# Altium schematic sheet PowCarbinBoard_Sensor.SchDoc
size A3
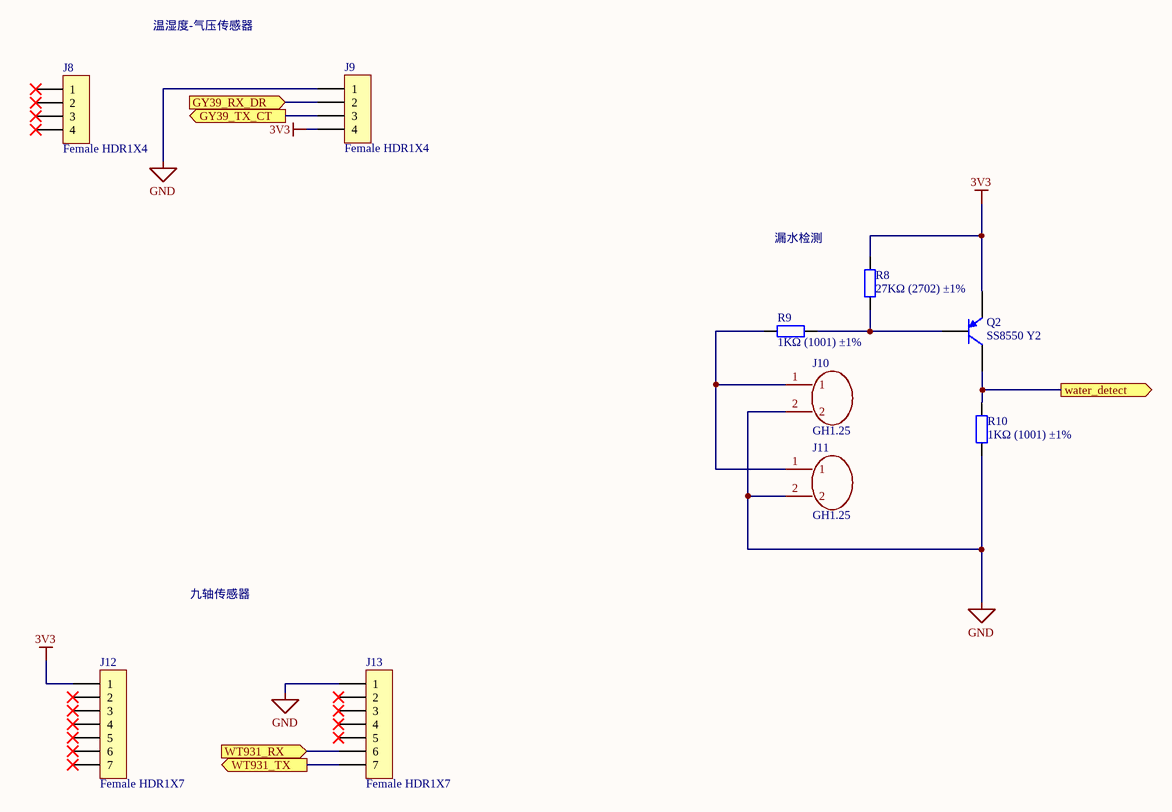
[diagram p0: PowCarbinBoard_Sensor.SchDoc]

## Parts
J8  Female HDR1X4  [Fe-HDR1X4/2.54-S]
J9  Female HDR1X4  [Fe-HDR1X4/2.54-S]
J10  GH1.25  [GH1.25 2pin]
J11  GH1.25  [GH1.25 2pin]
J12  Female HDR1X7  [Fe-HDR1X7/2.54-S]
J13  Female HDR1X7  [Fe-HDR1X7/2.54-S]
Q2  SS8550 Y2  [SOT-23(SOT-23-3)]
R8  27KΩ (2702) ±1%  [0603_R]
R9  1KΩ (1001) ±1%  [0603_R]
R10  1KΩ (1001) ±1%  [0603_R]

## Ports
GY39_RX_DR (in), GY39_TX_CT (out), water_detect (out), WT931_RX (in), WT931_TX (out)

## Nets
3V3: J9.4 J12.1 Q2.2(E) R8.2
GND: J9.1 J10.2 J11.2 J13.1 R10.1
GY39_RX_DR: J9.2 ; port GY39_RX_DR
GY39_TX_CT: J9.3 ; port GY39_TX_CT
water_detect: Q2.3(C) R10.2 ; port water_detect
WT931_RX: J13.6 ; port WT931_RX
WT931_TX: J13.7 ; port WT931_TX
NetJ10_1: J10.1 J11.1 R9.1
NetQ2_1: Q2.1(B) R8.1 R9.2

Not connected (* = marked no-connect by the designer): J8 1* 2* 3* 4*; J12 2* 3* 4* 5* 6* 7*; J13 2* 3* 4* 5*

## Notes on the sheet
- 温湿度-气压传感器
- 漏水检测
- 九轴传感器

## Library data of the parts
J10 J11 = GH1.25 2pin
Q2 = SOT-23 SS8550 Y2: 三极管; ComponentLink1Description: 供应商链接; ComponentLink1URL: http://www.szlcsc.com/product/details_9037.html; Package: SOT-23; Supplier: LC; SuppliersPartNumber: C8542
R8 = 0603 27KΩ (2702) 1%: 贴片电阻; ComponentLink1Description: 供应商链接; ComponentLink1URL: http://www.szlcsc.com/product/details_23694.html; Package: 0603; Supplier: LC; SuppliersPartNumber: C22967
R9 R10 = 0603 1KΩ (1001) 1%: 贴片电阻; ComponentLink1Description: 供应商链接; ComponentLink1URL: http://www.szlcsc.com/product/details_21904.html; Package: 0603; Supplier: LC; SuppliersPartNumber: C21190